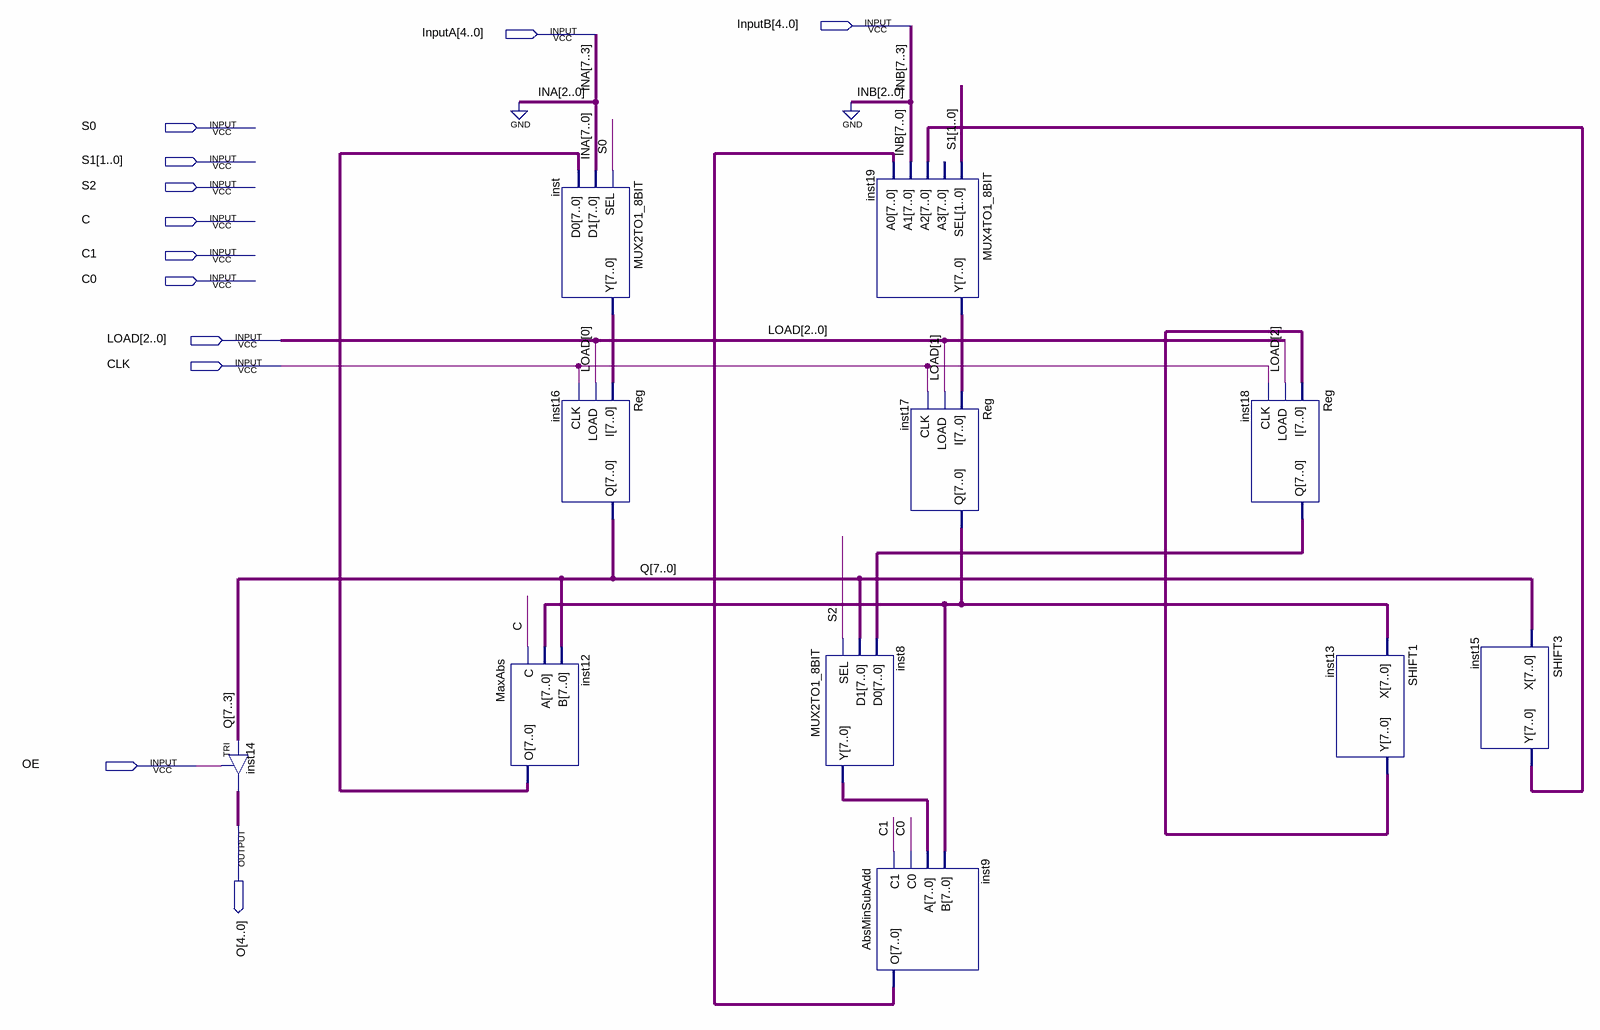
[diagram p0: schematic sheet]
// Quartus schematic datapath2.bdf as structural Verilog: 11 symbols, 12 pins
module datapath2 (
  input  [4:0] InputB,
  input  [4:0] InputA,
  input  S0,
  input  [1:0] S1,
  input  S2,
  input  C,
  input  C1,
  input  C0,
  input  [2:0] LOAD,
  input  CLK,
  input  OE,
  output [4:0] O
);

  wire [7:0] inst8_y, inst9_o, inst12_o, inst13_y, inst15_y, inst17_q, inst18_q, inst19_y, inst_y, Q;

  TRI inst14[4:0] (.IN(Q[7:3]), .OE(OE), .OUT(O));
  MaxAbs inst12 (.C(C), .A(inst17_q), .B(Q), .O(inst12_o));
  MUX2TO1_8BIT inst (.SEL(S0), .D1({InputA, 3'b000}), .D0(inst12_o), .Y(inst_y));
  Reg inst16 (.I(inst_y), .LOAD(LOAD[0]), .CLK(CLK), .Q(Q));
  MUX2TO1_8BIT inst8 (.SEL(S2), .D1(Q), .D0(inst18_q), .Y(inst8_y));
  MUX4TO1_8BIT inst19 (.SEL(S1), .A2(inst15_y), .A1({InputB, 3'b000}), .A0(inst9_o), .Y(inst19_y));  // open: A3
  Reg inst17 (.I(inst19_y), .LOAD(LOAD[1]), .CLK(CLK), .Q(inst17_q));
  AbsMinSubAdd inst9 (.C1(C1), .C0(C0), .A(inst8_y), .B(inst17_q), .O(inst9_o));
  Reg inst18 (.I(inst13_y), .LOAD(LOAD[2]), .CLK(CLK), .Q(inst18_q));
  SHIFT1 inst13 (.X(inst17_q), .Y(inst13_y));
  SHIFT3 inst15 (.X(Q), .Y(inst15_y));

  // Other names for the same wires on the sheet: INA[7:3] = InputA; INB[7:3] = InputB
endmodule
